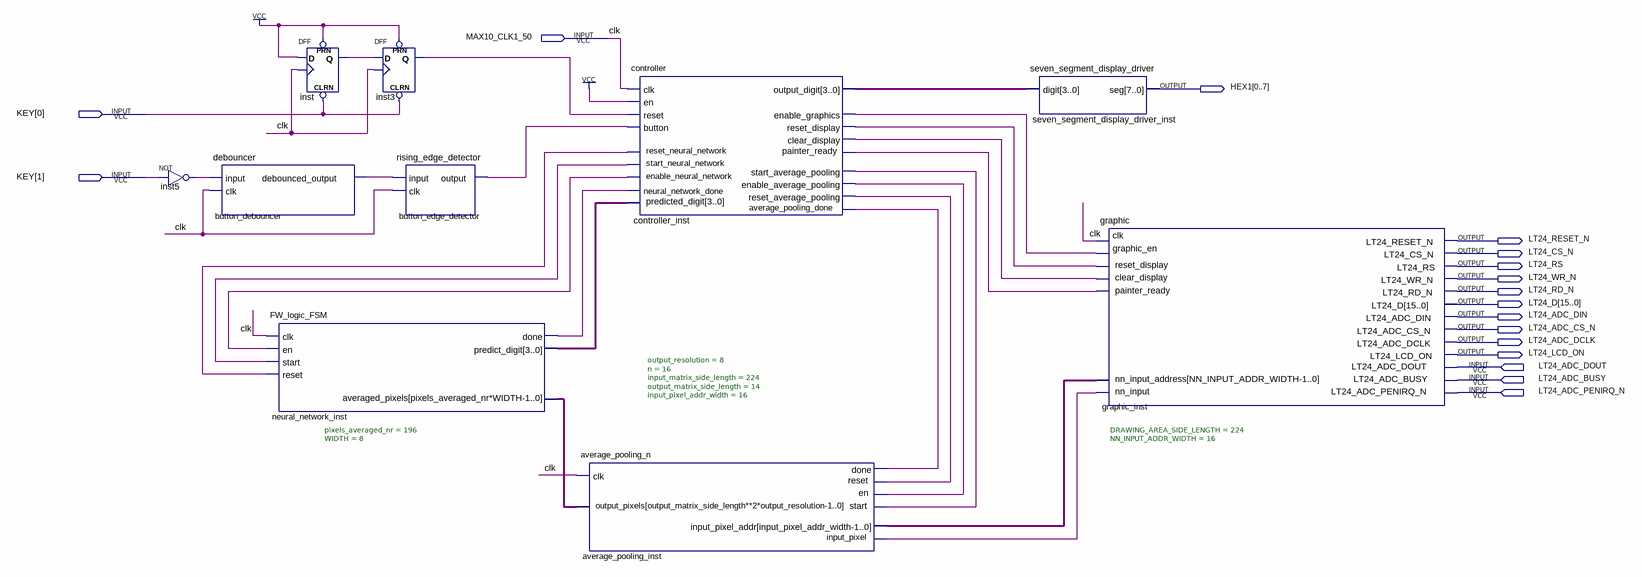
[diagram p0: schematic sheet]
// Quartus schematic handwritten_digit_recognition.bdf as structural Verilog: 10 symbols, 17 pins
module handwritten_digit_recognition (
  input  MAX10_CLK1_50,
  input  [1:0] KEY,
  input  LT24_ADC_DOUT,
  input  LT24_ADC_BUSY,
  input  LT24_ADC_PENIRQ_N,
  output [0:7] HEX1,
  output LT24_RESET_N,
  output LT24_CS_N,
  output LT24_RS,
  output LT24_WR_N,
  output LT24_RD_N,
  output [15:0] LT24_D,
  output LT24_ADC_DIN,
  output LT24_ADC_CS_N,
  output LT24_ADC_DCLK,
  output LT24_LCD_ON
);

  wire average_pooling_inst_done, button_debouncer_debounced_output, button_edge_detector_output,
       controller_inst_clear_display, controller_inst_enable_average_pooling,
       controller_inst_enable_graphics, controller_inst_enable_neural_network,
       controller_inst_reset_average_pooling, controller_inst_reset_display,
       controller_inst_reset_neural_network, controller_inst_start_average_pooling,
       controller_inst_start_neural_network, graphic_inst_nn_input, graphic_inst_painter_ready, inst3_q,
       inst5_out, inst_q, neural_network_inst_done;
  wire [3:0] controller_inst_output_digit, neural_network_inst_predict_digit;
  wire [15:0] average_pooling_inst_input_pixel_addr;
  wire [1567:0] average_pooling_inst_output_pixels;

  not inst5 (inst5_out, KEY[1]);
  debouncer button_debouncer (
    .\input (inst5_out), .clk(MAX10_CLK1_50), .debounced_output(button_debouncer_debounced_output));
  FW_logic_FSM #(.pixels_averaged_nr(196), .WIDTH(8)) neural_network_inst (
    .clk(MAX10_CLK1_50), .reset(controller_inst_reset_neural_network),
    .start(controller_inst_start_neural_network), .averaged_pixels(average_pooling_inst_output_pixels),
    .en(controller_inst_enable_neural_network), .predict_digit(neural_network_inst_predict_digit),
    .done(neural_network_inst_done));
  DFF inst (.CLRN(KEY[0]), .CLK(MAX10_CLK1_50), .D(1'b1), .PRN(1'b1), .Q(inst_q));
  DFF inst3 (.CLRN(KEY[0]), .CLK(MAX10_CLK1_50), .D(inst_q), .PRN(1'b1), .Q(inst3_q));
  rising_edge_detector button_edge_detector (
    .\input (button_debouncer_debounced_output), .clk(MAX10_CLK1_50), .\output (button_edge_detector_output));
  average_pooling_n #(.output_resolution(8), .n(16), .input_matrix_side_length(224), .output_matrix_side_length(14), .input_pixel_addr_width(16)) average_pooling_inst (
    .clk(MAX10_CLK1_50), .reset(controller_inst_reset_average_pooling),
    .en(controller_inst_enable_average_pooling), .start(controller_inst_start_average_pooling),
    .input_pixel(graphic_inst_nn_input), .input_pixel_addr(average_pooling_inst_input_pixel_addr),
    .output_pixels(average_pooling_inst_output_pixels), .done(average_pooling_inst_done));
  controller controller_inst (
    .clk(MAX10_CLK1_50), .en(1'b1), .reset(inst3_q), .button(button_edge_detector_output),
    .painter_ready(graphic_inst_painter_ready), .average_pooling_done(average_pooling_inst_done),
    .neural_network_done(neural_network_inst_done), .predicted_digit(neural_network_inst_predict_digit),
    .output_digit(controller_inst_output_digit), .clear_display(controller_inst_clear_display),
    .reset_display(controller_inst_reset_display), .enable_graphics(controller_inst_enable_graphics),
    .start_average_pooling(controller_inst_start_average_pooling),
    .enable_average_pooling(controller_inst_enable_average_pooling),
    .reset_average_pooling(controller_inst_reset_average_pooling),
    .start_neural_network(controller_inst_start_neural_network),
    .enable_neural_network(controller_inst_enable_neural_network),
    .reset_neural_network(controller_inst_reset_neural_network));
  seven_segment_display_driver seven_segment_display_driver_inst (.digit(controller_inst_output_digit), .seg(HEX1));
  graphic #(.DRAWING_AREA_SIDE_LENGTH(224), .NN_INPUT_ADDR_WIDTH(16)) graphic_inst (
    .graphic_en(controller_inst_enable_graphics), .clk(MAX10_CLK1_50),
    .nn_input_address(average_pooling_inst_input_pixel_addr), .LT24_ADC_PENIRQ_N(LT24_ADC_PENIRQ_N),
    .reset_display(controller_inst_reset_display), .clear_display(controller_inst_clear_display),
    .LT24_ADC_DOUT(LT24_ADC_DOUT), .LT24_ADC_BUSY(LT24_ADC_BUSY), .painter_ready(graphic_inst_painter_ready),
    .nn_input(graphic_inst_nn_input), .LT24_RESET_N(LT24_RESET_N), .LT24_CS_N(LT24_CS_N), .LT24_RS(LT24_RS),
    .LT24_WR_N(LT24_WR_N), .LT24_RD_N(LT24_RD_N), .LT24_D(LT24_D), .LT24_ADC_DIN(LT24_ADC_DIN),
    .LT24_ADC_CS_N(LT24_ADC_CS_N), .LT24_ADC_DCLK(LT24_ADC_DCLK), .LT24_LCD_ON(LT24_LCD_ON));

  // Other names for the same wires on the sheet: clk = MAX10_CLK1_50
endmodule
